# Altium schematic sheet GyroBoard.SchDoc
size A4
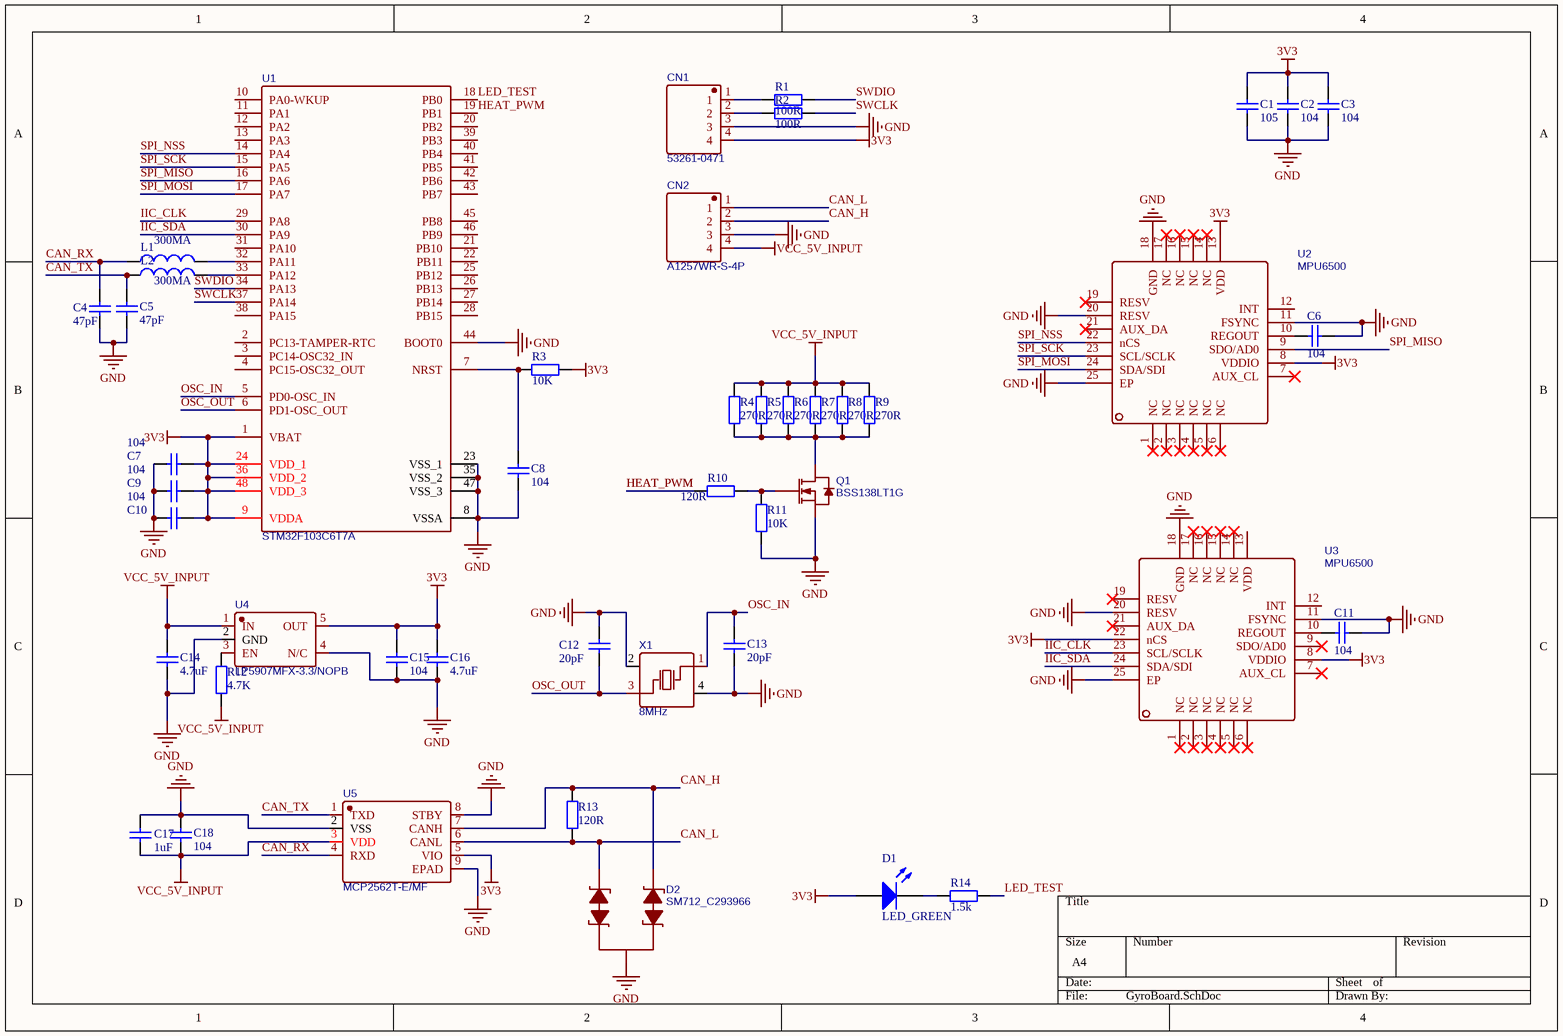
[diagram p0: GyroBoard.SchDoc]

## Parts
C1  105  [0402]
C2  104  [0402]
C3  104  [0402]
C4  47pF  [0402]
C5  47pF  [0402]
C6  104  [0402]
C7  104  [0402]
C8  104  [0402]
C9  104  [0402]
C10  104  [0402]
C11  104  [0402]
C12  20pF  [0402]
C13  20pF  [0402]
C14  4.7uF  [0402]
C15  104  [0402]
C16  4.7uF  [CAP-CASE-A_3216]
C17  1uF  [0402]
C18  104  [0402]
CN1  53261-0471  [532610471]
CN2  A1257WR-S-4P  [A1257WR-S-4P]
D1  LED_GREEN  [LED-0603]
D2  SM712_C293966  [SOT-23-3]
L1  value 300MA  [0402]  (hidden comment: CBG100505U310T)
L2  value 300MA  [0402]  (hidden comment: CBG100505U310T)
Q1  BSS138LT1G  [SOT-23(SOT-23-3)]
R1  100R  [0402]
R2  100R  [0402]
R3  10K  [0402]
R4  270R  [0402]
R5  270R  [0402]
R6  270R  [0402]
R7  270R  [0402]
R8  270R  [0402]
R9  270R  [0402]
R10  120R  [0402]
R11  10K  [0402]
R12  4.7K  [0402]
R13  120R  [0402]
R14  1.5k  [0402]
U1  STM32F103C6T7A  [QFP-48_LSA9.2-LSB9.2-H1.6-PITCH0.5-TL]
U2  MPU6500  [QFN24-EP]
U3  MPU6500  [QFN24-EP]
U4  LP5907MFX-3.3/NOPB  [SOT-23-5]
U5  MCP2562T-E/MF  [DFN-8_EP_3X3MM]
X1  8MHz  [SMD-5032_4P]

## Nets
3V3: C1.2 C2.2 C3.1 C7.1 C9.1 C10.1 C15.2 C16.2 CN1.4 D1.1(A) R3.2 U1.1(VBAT) U1.9(VDDA) U1.24(VDD_1) U1.36(VDD_2) U1.48(VDD_3) U2.8(VDDIO) U2.13(VDD) U3.8(VDDIO) U3.22(nCS) U4.5(OUT) U5.5(VIO)
GND: C1.1 C2.1 C3.2 C4.2 C5.2 C6.2 C7.2 C8.1 C9.2 C10.2 C11.2 C12.1 C13.2 C14.2 C15.1 C16.1 C17.1 C18.1 CN1.3 CN2.3 D2.3 Q1.2(S) R11.1 U1.8(VSSA) U1.23(VSS_1) U1.35(VSS_2) U1.44(BOOT0) U1.47(VSS_3) U2.11(FSYNC) U2.18(GND) U2.20(RESV) U2.25(EP) U3.11(FSYNC) U3.18(GND) U3.20(RESV) U3.25(EP) U4.2(GND) U4.4(N/C) U5.2(VSS) U5.8(STBY) U5.9(EPAD) X1.2(GND) X1.4(GND)
VCC_5V_INPUT: C14.1 C17.2 C18.2 CN2.4 R4.1 R5.1 R6.1 R7.1 R8.1 R9.1 R12.1 U4.1(IN) U5.3(VDD)
CAN_H: CN2.2 D2.1 R13.2 U5.7(CANH)
CAN_L: CN2.1 D2.2 R13.1 U5.6(CANL)
CAN_RX: C4.1 L1.1 U5.4(RXD)
CAN_TX: C5.1 L2.1 U5.1(TXD)
HEAT_PWM: R10.2 U1.19(PB1)
IIC_CLK: U1.29(PA8) U3.23(SCL/SCLK)
IIC_SDA: U1.30(PA9) U3.24(SDA/SDI)
LED_TEST: R14.1 U1.18(PB0)
OSC_IN: C13.1 U1.5(PD0-OSC_IN) X1.1(OSC1)
OSC_OUT: C12.2 U1.6(PD1-OSC_OUT) X1.3(OSC2)
SPI_MISO: U1.16(PA6) U2.9(SDO/AD0)
SPI_MOSI: U1.17(PA7) U2.24(SDA/SDI)
SPI_NSS: U1.14(PA4) U2.22(nCS)
SPI_SCK: U1.15(PA5) U2.23(SCL/SCLK)
SWCLK: R2.1 U1.37(PA14)
SWDIO: R1.1 U1.34(PA13)
NetC6_1: C6.1 U2.10(REGOUT)
NetC8_2: C8.2 R3.1 U1.7(NRST)
NetC11_1: C11.1 U3.10(REGOUT)
NetCN1_1: CN1.1 R1.2
NetCN1_2: CN1.2 R2.2
NetD1_2: D1.2(K) R14.2
NetL1_2: L1.2 U1.32(PA11)
NetL2_2: L2.2 U1.33(PA12)
NetQ1_1: Q1.1(G) R10.1 R11.2
NetQ1_3: Q1.3(D) R4.2 R5.2 R6.2 R7.2 R8.2 R9.2
NetR12_2: R12.2 U4.3(EN)

Not connected (* = marked no-connect by the designer): U1 2(PC13-TAMPER-RTC) 3(PC14-OSC32_IN) 4(PC15-OSC32_OUT) 10(PA0-WKUP) 11(PA1) 12(PA2) 13(PA3) 20(PB2) 21(PB10) 22(PB11) 25(PB12) 26(PB13) 27(PB14) 28(PB15) 31(PA10) 38(PA15) 39(PB3) 40(PB4) 41(PB5) 42(PB6) 43(PB7) 45(PB8) 46(PB9); U2 1(NC)* 2(NC)* 3(NC)* 4(NC)* 5(NC)* 6(NC)* 7(AUX_CL)* 12(INT) 14(NC)* 15(NC)* 16(NC)* 17(NC)* 19(RESV)* 21(AUX_DA)*; U3 1(NC)* 2(NC)* 3(NC)* 4(NC)* 5(NC)* 6(NC)* 7(AUX_CL)* 9(SDO/AD0)* 12(INT) 13(VDD) 14(NC)* 15(NC)* 16(NC)* 17(NC)* 19(RESV)* 21(AUX_DA)*

## Library data of the parts
C1-C18 = Cap: Capacitor; Value: 22pF; Published: 8-Jun-2000; LatestRevisionDate: 17-Jul-2002; LatestRevisionNote: Re-released for DXP Platform.; PackageReference: RAD-0.3; Publisher: Altium Limited
CN1 = 53261-0471: BOM_Manufacturer: MOLEX; BOM_Manufacturer Part: 53261-0871; Contributor: LCSC; BOM_Supplier: LCSC; BOM_Supplier Part: C240848; spicePre: C
CN2 = A1257WV-S-4P: BOM_Manufacturer: MOLEX; BOM_Manufacturer Part: 53261-0871; Contributor: LCSC; BOM_Supplier: LCSC; BOM_Supplier Part: C240848; spicePre: C
D1 = LED0: Typical INFRARED GaAs LED; Published: 8-Jun-2000; LatestRevisionDate: 08-Jul-2005; LatestRevisionNote: Mech Layer 1 removed.; PackageReference: LED-0; Publisher: Altium Limited; PackageDescription: LED; 2 Leads
D2 = SM712_C293966: BOM_Manufacturer: DOWO; BOM_Manufacturer Part: SM712; Contributor: LCSC; BOM_Supplier: LCSC; BOM_Supplier Part: C293966; spicePre: D
L1 L2 = Inductor: Code_IEC: 1005; Published: 8-Jun-2000; LatestRevisionDate: 29-May-2009; LatestRevisionNote: IPC-7351 Footprint Added.; PackageReference: 0402-A; Publisher: Altium Limited; PackageDescription: Chip Inductor; Code_JEITA: 0402
Q1 = BSS138LT1G: BOM_Manufacturer: ON; SMT Type: Extend; BOM_Supplier: LCSC; BOM_Manufacturer Part: BSS138LT1G; BOM_Supplier Part: C82045; BOM_LCSC Assembly: Yes; spicePre: Q
R1 R2 R4-R10 R12-R14 = Res2: Resistor; Value: 10K; Published: 8-Jun-2000; LatestRevisionDate: 17-Jul-2002; LatestRevisionNote: Re-released for DXP Platform.; PackageReference: AXIAL-0.4; Publisher: Altium Limited
R3 R11 = Res2: Resistor; Published: 8-Jun-2000; LatestRevisionDate: 17-Jul-2002; LatestRevisionNote: Re-released for DXP Platform.; PackageReference: AXIAL-0.4; Publisher: Altium Limited; Value: 10K
U1 = STM32F103C6T7A: BOM_Manufacturer: STMicroelectronics; Contributor: LCSC; SMT Type: Extend; BOM_Supplier: LCSC; BOM_Supplier Part: C222074; BOM_Manufacturer Part: STM32F103C6T7A; BOM_LCSC Assembly: Yes; spicePre: U
U2 U3 = MPU6500_1: BOM_Manufacturer: InvenSense; BOM_Supplier: LCSC; BOM_Manufacturer Part: MPU6500; BOM_Supplier Part: C50278; spicePre: U
U4 = LP5907MFX-3.3/NOPB: BOM_Manufacturer: Texas Instruments; Contributor: LCSC; SMT Type: Extend; BOM_Supplier: LCSC; BOM_Supplier Part: C80670; BOM_Manufacturer Part: LP5907MFX-3.3/NOPB; BOM_LCSC Assembly: Yes; spicePre: U
U5 = MCP2562T-E/MF: BOM_Manufacturer: Microchip Tech; Contributor: LCSC; BOM_Supplier: LCSC; BOM_Supplier Part: C191416; BOM_Manufacturer Part: MCP2562T-E/MF; spicePre: U
X1 = 8MHz: BOM_Manufacturer: TAE; BOM_Manufacturer Part: SMD-5032_4P8M20pf20ppm; nameAlias: Frequency; Contributor: LCSC; BOM_Supplier: LCSC; BOM_Supplier Part: C133333; spicePre: X; spiceSymbolName: SMD-5032_4P8M20PF20PPM